# EAGLE schematic stm_32_v2.0 (EAGLE 9.4.2)
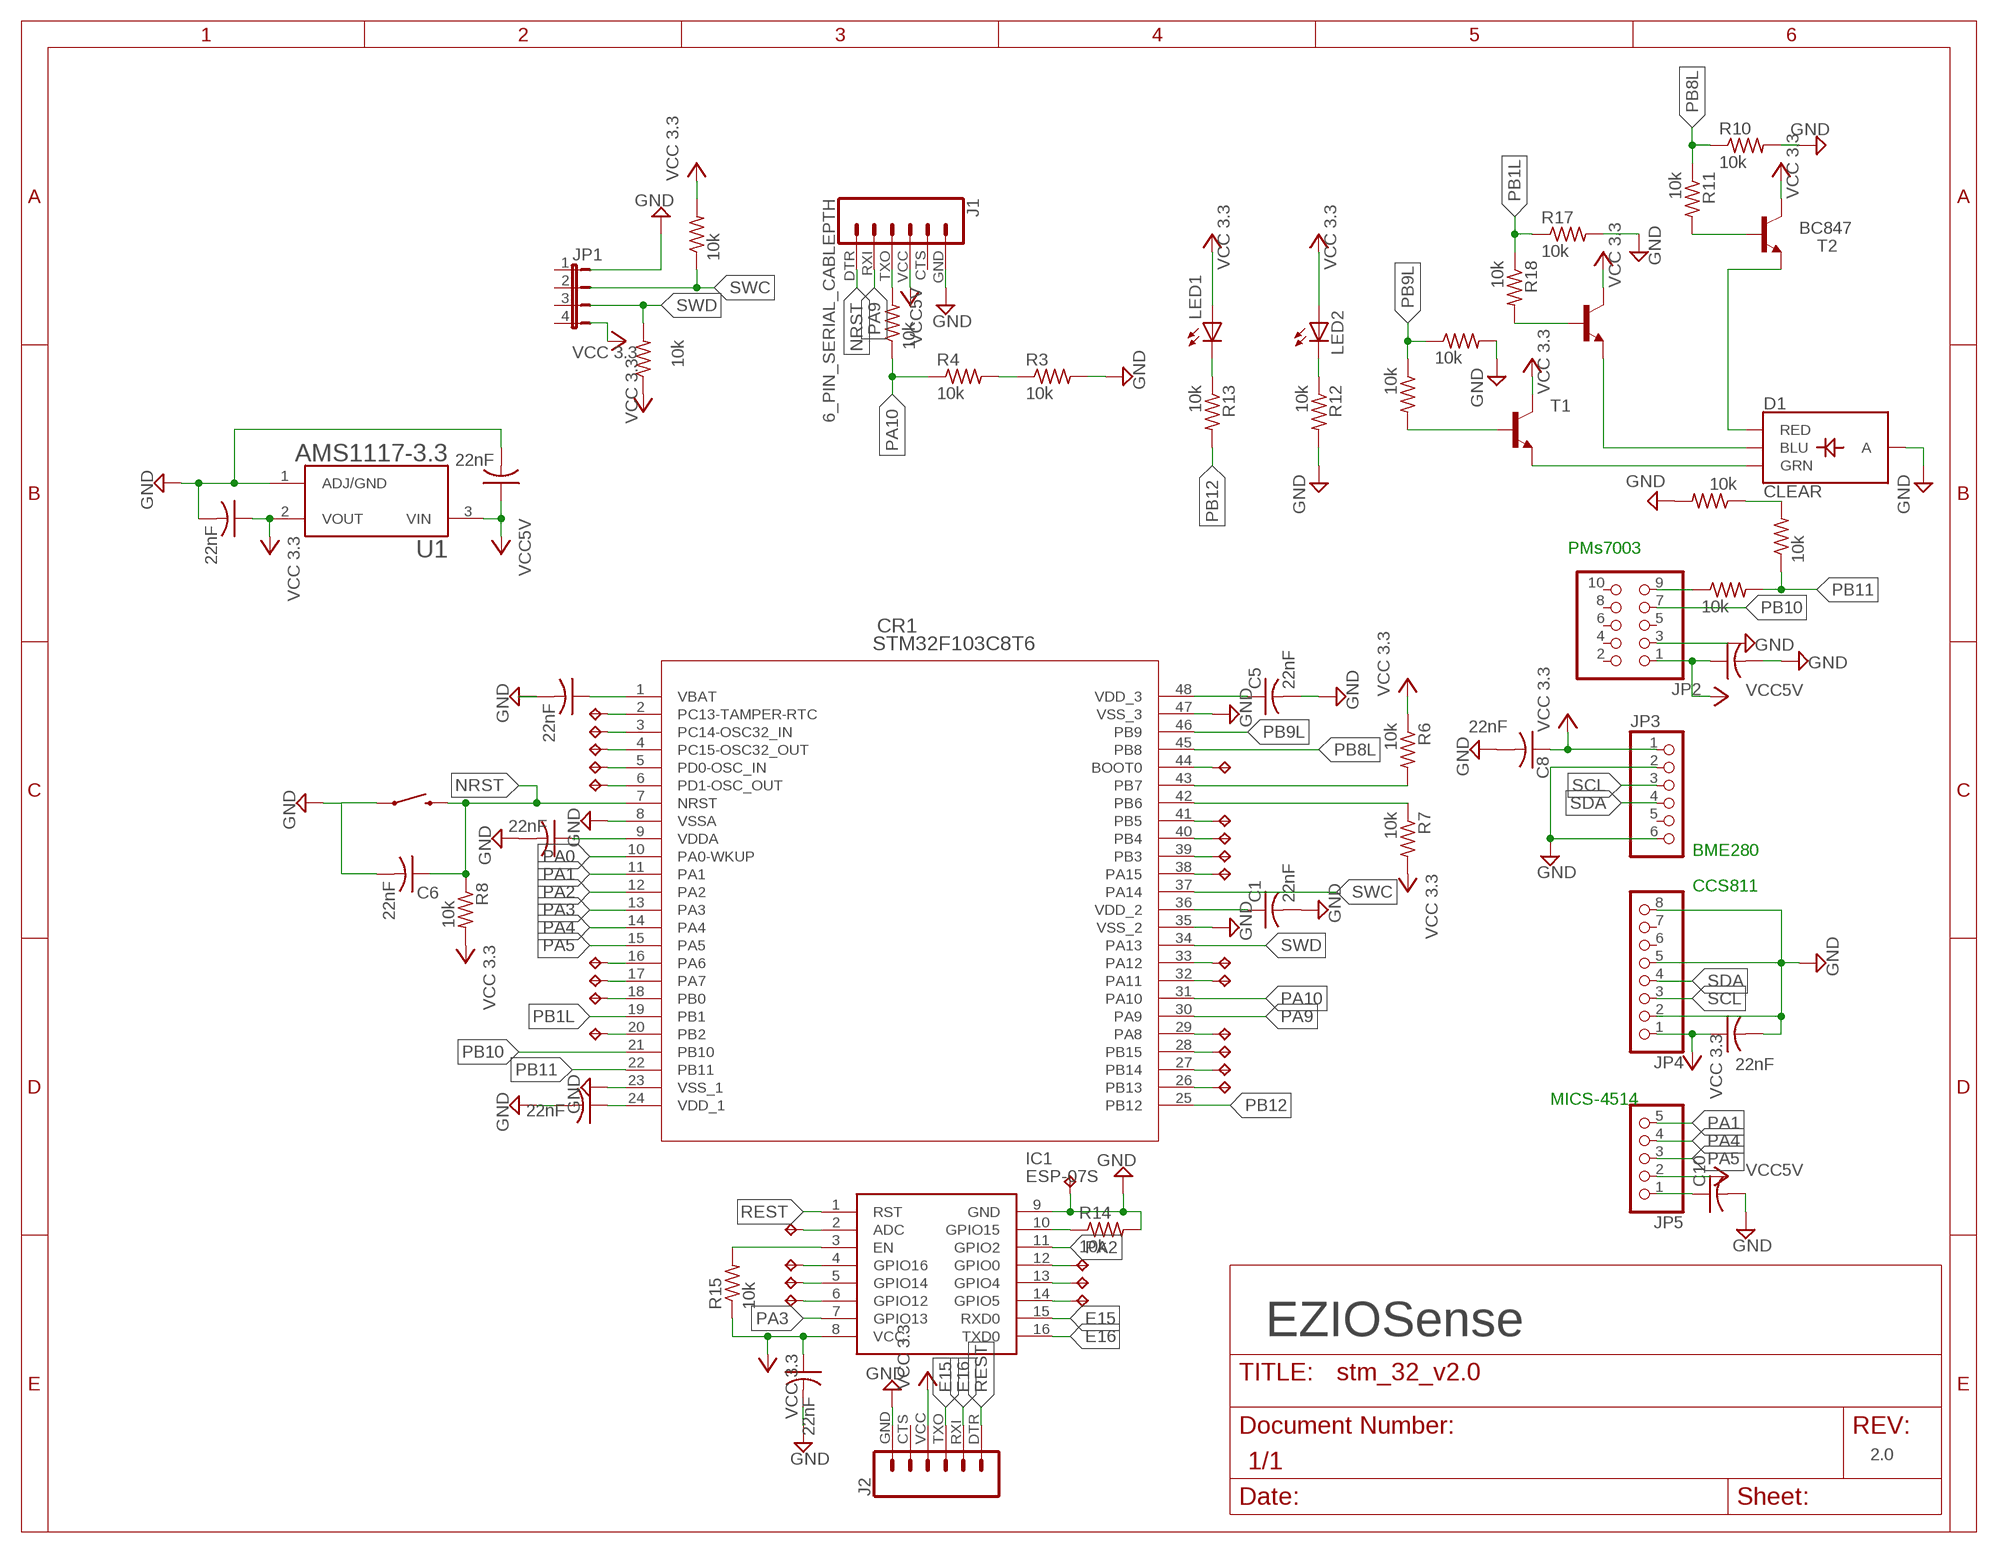
[diagram p0: schematic, sheet 1]

## Parts
C1  22nF  C-USC0805  [C0805]
C2  22nF  C-USC0805  [C0805]
C3  22nF  C-USC0805  [C0805]
C4  22nF  C-USC0805  [C0805]
C5  22nF  C-USC0805  [C0805]
C6  22nF  C-USC0805  [C0805]
C7  22nF  C-USC0805  [C0805]
C8  22nF  C-USC0805  [C0805]
C9  22nF  C-USC0805  [C0805]
C10  22nF  C-USC0805  [C0805]
C11  22nF  C-USC0805  [C0805]
C12  22nF  C-USC0805  [C0805]
C13  22nF  C-USC0805  [C0805]
CR1  STM32F103C8T6  [LQFP-48]
D1  CLEAR  LED-RGB-CACLEAR  [LED-RGB-THRU]
IC1  ESP-07S  [ESP07S]
J1  6_PIN_SERIAL_CABLEPTH  [FTDI_BASIC]
J2  6_PIN_SERIAL_CABLEPTH  [FTDI_BASIC]
JP1  JP4E  [JP4]
JP2  PINHD-2X5  [2X05]
JP3  PINHD-1X6  [1X06]
JP4  PINHD-1X8/90  [1X08/90]
JP5  PINHD-1X55X2MM  [1_05X2MM]
LED1  LEDCHIP-LED0805  [CHIP-LED0805]
LED2  LEDCHIP-LED0805  [CHIP-LED0805]
R1  10k  R-US_M0805  [M0805]
R2  10k  R-US_M0805  [M0805]
R3  10k  R-US_M0805  [M0805]
R4  10k  R-US_M0805  [M0805]
R5  10k  R-US_M0805  [M0805]
R6  10k  R-US_M0805  [M0805]
R7  10k  R-US_M0805  [M0805]
R8  10k  R-US_M0805  [M0805]
R9  10k  R-US_M0805  [M0805]
R10  10k  R-US_M0805  [M0805]
R11  10k  R-US_M0805  [M0805]
R12  10k  R-US_M0805  [M0805]
R13  10k  R-US_M0805  [M0805]
R14  10k  R-US_M0805  [M0805]
R15  10k  R-US_M0805  [M0805]
R16  10k  R-US_M0805  [M0805]
R17  10k  R-US_M0805  [M0805]
R18  10k  R-US_M0805  [M0805]
R19  10k  R-US_M0805  [M0805]
R20  10k  R-US_M0805  [M0805]
R21  10k  R-US_M0805  [M0805]
S1  MOMENTARY-SWITCH-SPST-PTH-6.0MM  [TACTILE_SWITCH_PTH_6.0MM]
T1  BC847  [SOT23]
T2  BC847  [SOT23]
T3  BC847  [SOT23]
TP1  TPB1,27  [B1,27]
TP2  TPB1,27  [B1,27]
TP3  TPB1,27  [B1,27]
TP4  TPB1,27  [B1,27]
TP5  TPB1,27  [B1,27]
TP6  TPB1,27  [B1,27]
TP7  TPB1,27  [B1,27]
TP8  TPB1,27  [B1,27]
TP9  TPB1,27  [B1,27]
TP10  TPB1,27  [B1,27]
TP11  TPB1,27  [B1,27]
TP12  TPB1,27  [B1,27]
TP13  TPB1,27  [B1,27]
TP14  TPB1,27  [B1,27]
TP15  TPB1,27  [B1,27]
TP16  TPB1,27  [B1,27]
TP17  TPB1,27  [B1,27]
TP18  TPB1,27  [B1,27]
TP19  TPB1,27  [B1,27]
TP20  TPB1,27  [B1,27]
TP21  TPB1,27  [B1,27]
TP22  TPB1,27  [B1,27]
TP23  TPB1,27  [B1,27]
TP24  TPB1,27  [B1,27]
TP25  TPB1,27  [B1,27]
TP26  TPB1,27  [B1,27]
TP27  TPB1,27  [B1,27]
TP28  TPB1,27  [B1,27]
U1  AMS1117-3.3  [SOT229P700X180-4N]

## Nets
E15: IC1.15(RXD0) J2.TXO
E16: IC1.16(TXD0) J2.RXI
GND: C1.2 C2.2 C3.2 C4.2 C5.2 C7.2 C8.2 C9.2 C10.2 C11.2 CR1.8(VSSA) CR1.23(VSS_1) CR1.35(VSS_2) CR1.47(VSS_3) D1.2(A) IC1.9(GND) J1.GND J2.GND JP2.3 JP3.2 JP3.6 JP4.2 JP4.5 JP4.8 R3.2 R9.2 R10.2 R12.2 R14.2 R17.2 R21.2 TP24.TP
N$1: C4.1 CR1.1(VBAT)
N$2: J1.TXO R5.2
N$3: C3.1 CR1.9(VDDA)
N$4: R3.1 R4.2
N$5: C2.1 CR1.24(VDD_1)
N$6: C5.1 CR1.48(VDD_3)
N$7: C1.1 CR1.36(VDD_2)
N$8: CR1.43(PB7) R6.2
N$9: CR1.42(PB6) R7.1
N$10: CR1.33(PA12) TP14.TP
N$11: CR1.41(PB5) TP2.TP
N$12: CR1.40(PB4) TP3.TP
N$13: CR1.39(PB3) TP4.TP
N$14: CR1.38(PA15) TP13.TP
N$15: CR1.44(BOOT0) TP12.TP
N$16: CR1.32(PA11) TP15.TP
N$17: CR1.29(PA8) TP1.TP
N$18: CR1.28(PB15) TP16.TP
N$19: CR1.27(PB14) TP18.TP
N$20: CR1.26(PB13) TP19.TP
N$21: CR1.2(PC13-TAMPER-RTC) TP9.TP
N$22: CR1.3(PC14-OSC32_IN) TP7.TP
N$23: CR1.4(PC15-OSC32_OUT) TP11.TP
N$24: CR1.5(PD0-OSC_IN) TP8.TP
N$25: CR1.6(PD1-OSC_OUT) TP10.TP
N$27: CR1.16(PA6) TP17.TP
N$28: C6.2 S1.1 ; supply symbol labelled GND
N$29: CR1.17(PA7) TP5.TP
N$30: CR1.18(PB0) TP6.TP
N$31: CR1.20(PB2) TP20.TP
N$32: D1.3(GRN) T1.2(E)
N$33: D1.4(BLU) T3.2(E)
N$34: R16.2 T1.1(B)
N$35: R18.2 T3.1(B)
N$36: R11.2 T2.1(B)
N$37: D1.1(RED) T2.2(E)
N$38: LED1.C R13.1
N$39: LED2.C R12.1
N$40: IC1.12(GPIO0) TP23.TP
N$41: R20.2 R21.1
N$42: C10.1 JP5.1
N$43: JP2.9 R19.1
N$44: IC1.13(GPIO4) TP22.TP
N$45: IC1.14(GPIO5) TP21.TP
N$46: IC1.10(GPIO15) R14.1
N$47: IC1.3(EN) R15.2
N$48: IC1.2(ADC) TP25.TP
N$49: IC1.4(GPIO16) TP26.TP
N$50: IC1.5(GPIO14) TP27.TP
N$51: IC1.6(GPIO12) TP28.TP
NRST: C6.1 CR1.7(NRST) J1.DTR R8.1 S1.3
PA0: CR1.10(PA0-WKUP)
PA1: CR1.11(PA1) JP5.5
PA2: CR1.12(PA2) IC1.11(GPIO2)
PA3: CR1.13(PA3) IC1.7(GPIO13)
PA4: CR1.14(PA4) JP5.4
PA5: CR1.15(PA5) JP5.3
PA9: CR1.30(PA9) J1.RXI
PA10: CR1.31(PA10) R4.1 R5.1
PB1L: CR1.19(PB1) R17.1 R18.1
PB8L: CR1.45(PB8) R10.1 R11.1
PB9L: CR1.46(PB9) R9.1 R16.1
PB10: CR1.21(PB10) JP2.7
PB11: CR1.22(PB11) R19.2 R20.1
PB12: CR1.25(PB12) R13.2
REST: IC1.1(RST) J2.DTR
SCL: JP3.3 JP4.3
SDA: JP3.4 JP4.4
SWC: CR1.37(PA14) R1.1
SWD: CR1.34(PA13) R2.2
VCC: C7.1 C8.1 C9.1 C11.1 C12.1 C13.1 IC1.8(VCC) J1.VCC J2.VCC JP2.1 JP3.1 JP4.1 JP5.2 LED1.A LED2.A R1.2 R2.1 R6.1 R7.2 R8.2 R15.1 T1.3(C) T2.3(C) T3.3(C) U1.2(VOUT) U1.3(VIN) ; supply symbol labelled VCC 3.3, VCC5V
VCC5V: C12.2 C13.2 U1.1(ADJ/GND) ; supply symbol labelled GND
Unconnected: J1.CTS J2.CTS JP1.1 JP1.2 JP1.3 JP1.4 JP2.2 JP2.4 JP2.5 JP2.6 JP2.8 JP2.10 JP3.5 JP4.6 JP4.7

## Notes on the sheet
- PMs7003
- BME280
- CCS811
- MICS-4514
- EZIOSense
- 2.0

## Library data of the parts
C1-C13 = adafruit:C-US: CAPACITOR, American symbol
CR1 = stm32f103c8t6:STM32F103C8T6; MANUFACTURER_PART_NUMBER: STM32F103C8T6; VENDOR: STMicroelectronics
D1 = SparkFun-LED:LED-RGB-CA: LED-RGB Diffused Common Anode Packages: LED RGB-THRU P-LCC-4-3 LED-TRICOLOR-SMD SparkFun Products: RGB Diffused Common Anode- Diffuse <[https://www.sparkfun.com/products/10821]> RGB Diffused Common Anode - Clear <[https://www.sparkfun.com/products/10820]> Qduino Mini <[https://www.sparkfun.com/products/13614]> Triple Output LED RGB - SMD <https://www.sparkfun.com/products/7844>; PROD_ID: DIO-10631
IC1 = ESP-07S:ESP-07S: RF Solutions ESP-07S 3 3.6V WiFi Module, FTP, HTTP, IPv4, TCP/IP GPIO, HSPI, I2C, I2S, IR, PWM, UART Source: Datasheet <http://uk.rs-online.com/web/p/products/1372785>; DESCRIPTION: RF Solutions ESP-07S 3 3.6V WiFi Module, FTP, HTTP, IPv4, TCP/IP GPIO, HSPI, I2C, I2S, IR, PWM, UART; HEIGHT: 3mm; MANUFACTURER_NAME: RF SOLUTIONS; MANUFACTURER_PART_NUMBER: ESP-07S; RS_PART_NUMBER: 1372785; RS_PRICE-STOCK: http://uk.rs-online.com/web/p/products/1372785
J1 J2 = SparkFun-Connectors:6_PIN_SERIAL_CABLE: 6-pin header connection for use with the "FTDI BASIC" pinout - CABLE SIDE. Also known as "Arduino Serial Program Header". This is used on a design to provide a 6-pin connection point for serial communication usually from a USB cable (D+/D-) to these headers (RX/TX). It also has the remaining pins necessary for programming in the Arduino evironment (DTR, GND, and sometimes VCC). Note, this device has "CABLE" in the name. It is intended to be used on a design that usually lives on the end of your USB cable and prvides the converter chip (FTDI232 or FTDI231x) to commnicate serial RX/TX. The "sister" device, named "TARGET" is inteneded to be used on a design that contains a target micro-controller that you wish to program. You can populate with some of these: Female Headers <https://www.sparkfun.com/products/115> (PRT-00115) For reference (or to suit your programming needs) check out these designs: SparkFun FTDI Basic Breakout - 5V <https://www.sparkfun.com/products/9716> (DEV-09716) SparkFun FTDI Basic Breakout - 3.3V <https://www.sparkfun.com/products/9873> (DEV-09873) SparkFun FTDI SmartBasic <https://www.sparkfun.com/products/12935> (DEV-12935) SparkFun Beefy 3 - FTDI Basic Breakout <https://www.sparkfun.com/products/13746> (DEV-13746)
JP1 = jumper:JP4E: JUMPER
JP2 = pinhead:PINHD-2X5: PIN HEADER
JP3 = pinhead:PINHD-1X6: PIN HEADER
JP4 = pinhead:PINHD-1X8: PIN HEADER
JP5 = pinhead:PINHD-1X5: PIN HEADER
LED1 LED2 = adafruit:LED: LED OSRAM: - CHIPLED LG R971, LG N971, LY N971, LG Q971, LY Q971, LO R971, LY R971 LH N974, LH R974 LS Q976, LO Q976, LY Q976 LO Q996 - Hyper CHIPLED LW Q18S LB Q993, LB Q99A, LB R99A - SideLED LS A670, LO A670, LY A670, LG A670, LP A670 LB A673, LV A673, LT A673, LW A673 LH A674 LY A675 LS A676, LA A676, LO A676, LY A676, LW A676 LS A679, LY A679, LG A679 - Hyper Micro SIDELED® LS Y876, LA Y876, LO Y876, LY Y876 LT Y87S - SmartLED LW L88C, LW L88S LB L89C, LB L89S, LG L890 LS L89K, LO L89K, LY L89K LS L896, LA L896, LO L896, LY L896 - TOPLED LS T670, LO T670, LY T670, LG T670, LP T670 LSG T670, LSP T670, LSY T670, LOP T670, LYG T670 LG T671, LOG T671, LSG T671 LB T673, LV T673, LT T673, LW T673 LH T674 LS T676, LA T676, LO T676, LY T676, LB T676, LH T676, LSB T676, LW T676 LB T67C, LV T67C, LT T67C, LS T67K, LO T67K, LY T67K, LW E67C LS E67B, LA E67B, LO E67B, LY E67B, LB E67C, LV E67C, LT E67C LW T67C LS T679, LY T679, LG T679 LS T770, LO T770, LY T770, LG T770, LP T770 LB T773, LV T773, LT T773, LW T773 LH T774 LS E675, LA E675, LY E675, LS T675 LS T776, LA T776, LO T776, LY T776, LB T776 LHGB T686 LT T68C, LB T68C - Hyper Mini TOPLED® LB M676 - Mini TOPLED Santana® LG M470 LS M47K, LO M47K, LY M47K Source: http://www.osram.convergy.de/
R1-R21 = resistor:R-US_: RESISTOR, American symbol
S1 = SparkFun-Switches:MOMENTARY-SWITCH-SPST: Momentary Switch (Pushbutton) - SPST Normally-open (NO) SPST momentary switches (buttons, pushbuttons). Variants PTH-12MM - 12mm square, through-hole Momentary Pushbutton Switch - 12mm Square <https://www.sparkfun.com/products/9190> (COM-09190) PTH-6.0MM, PTH-6.0MM-KIT - 6.0mm square, through-hole Mini Pushbutton Switch <https://www.sparkfun.com/products/97> (COM-00097) KIT package intended for soldering kit's - only one side of pads' copper is exposed. PTH-RIGHT-ANGLE-KIT - Right-angle, through-hole Right Angle Tactile Button <https://www.sparkfun.com/products/10791> - Used on SparkFun BigTime Watch Kit <https://www.sparkfun.com/products/11734> SMD-12MM - 12mm square, surface-mount Tactile Button - SMD (12mm) <https://www.sparkfun.com/products/12993> (COM-12993) Used on SparkFun PicoBoard <https://www.sparkfun.com/products/11888> SMD-4.5MM - 4.5mm Square Trackball Switch Used on SparkFun Blackberry Trackballer Breakout <https://www.sparkfun.com/products/13169> SMD-4.6MMX2.8MM - 4.60mm x 2.80mm, surface mount Used on SparkFun SAMD21 Mini Breakout <https://www.sparkfun.com/products/13664> SMD-5.2MM, SMD-5.2-REDUNDANT - 5.2mm square, surface-mount Mini Pushbutton Switch - SMD <https://www.sparkfun.com/products/8720> (COM-08720) Used on Arduino Pro Mini <https://www.sparkfun.com/products/11114> REDUNDANT package connects both switch circuits together SMD-6.0X3.5MM - 6.0 x 3.5mm, surface mount Momentary Reset Switch SMD <https://www.sparkfun.com/products/8229> (COM-08229) SMD-6.2MM-TALL - 6.2mm square, surface mount Tactile Button - SMD (6mm) <https://www.sparkfun.com/products/12992> Used on SparkFun Digital Sandbox <https://www.sparkfun.com/products/12651> SMD-RIGHT-ANGLE - Right-angle, surface mount Used on SparkFun Block for Intel® Edison - Arduino <https://www.sparkfun.com/products/13036>; PROD_ID: SWCH-08441; SF_SKU: COM-00097
T1-T3 = transistor-neu-to92:BC847: NPN TRANSISTOR
TP1-TP28 = BeagleBone_Blue_R3:TP: Test pad
U1 = AMS1117-3.3:AMS1117-3.3: Sot223/Pkg 1-Amp 3.3-Volt Low Drop Out Voltage Regulatator; AVAILABILITY: Unavailable; DESCRIPTION: Sot223/Pkg 1-Amp 3.3-Volt Low Drop Out Voltage Regulatator; MF: Advanced Monolithic Systems; MP: AMS1117-3.3; PACKAGE: None; PRICE: None